# EAGLE design blink1mk3_card (EAGLE 9.0.1)
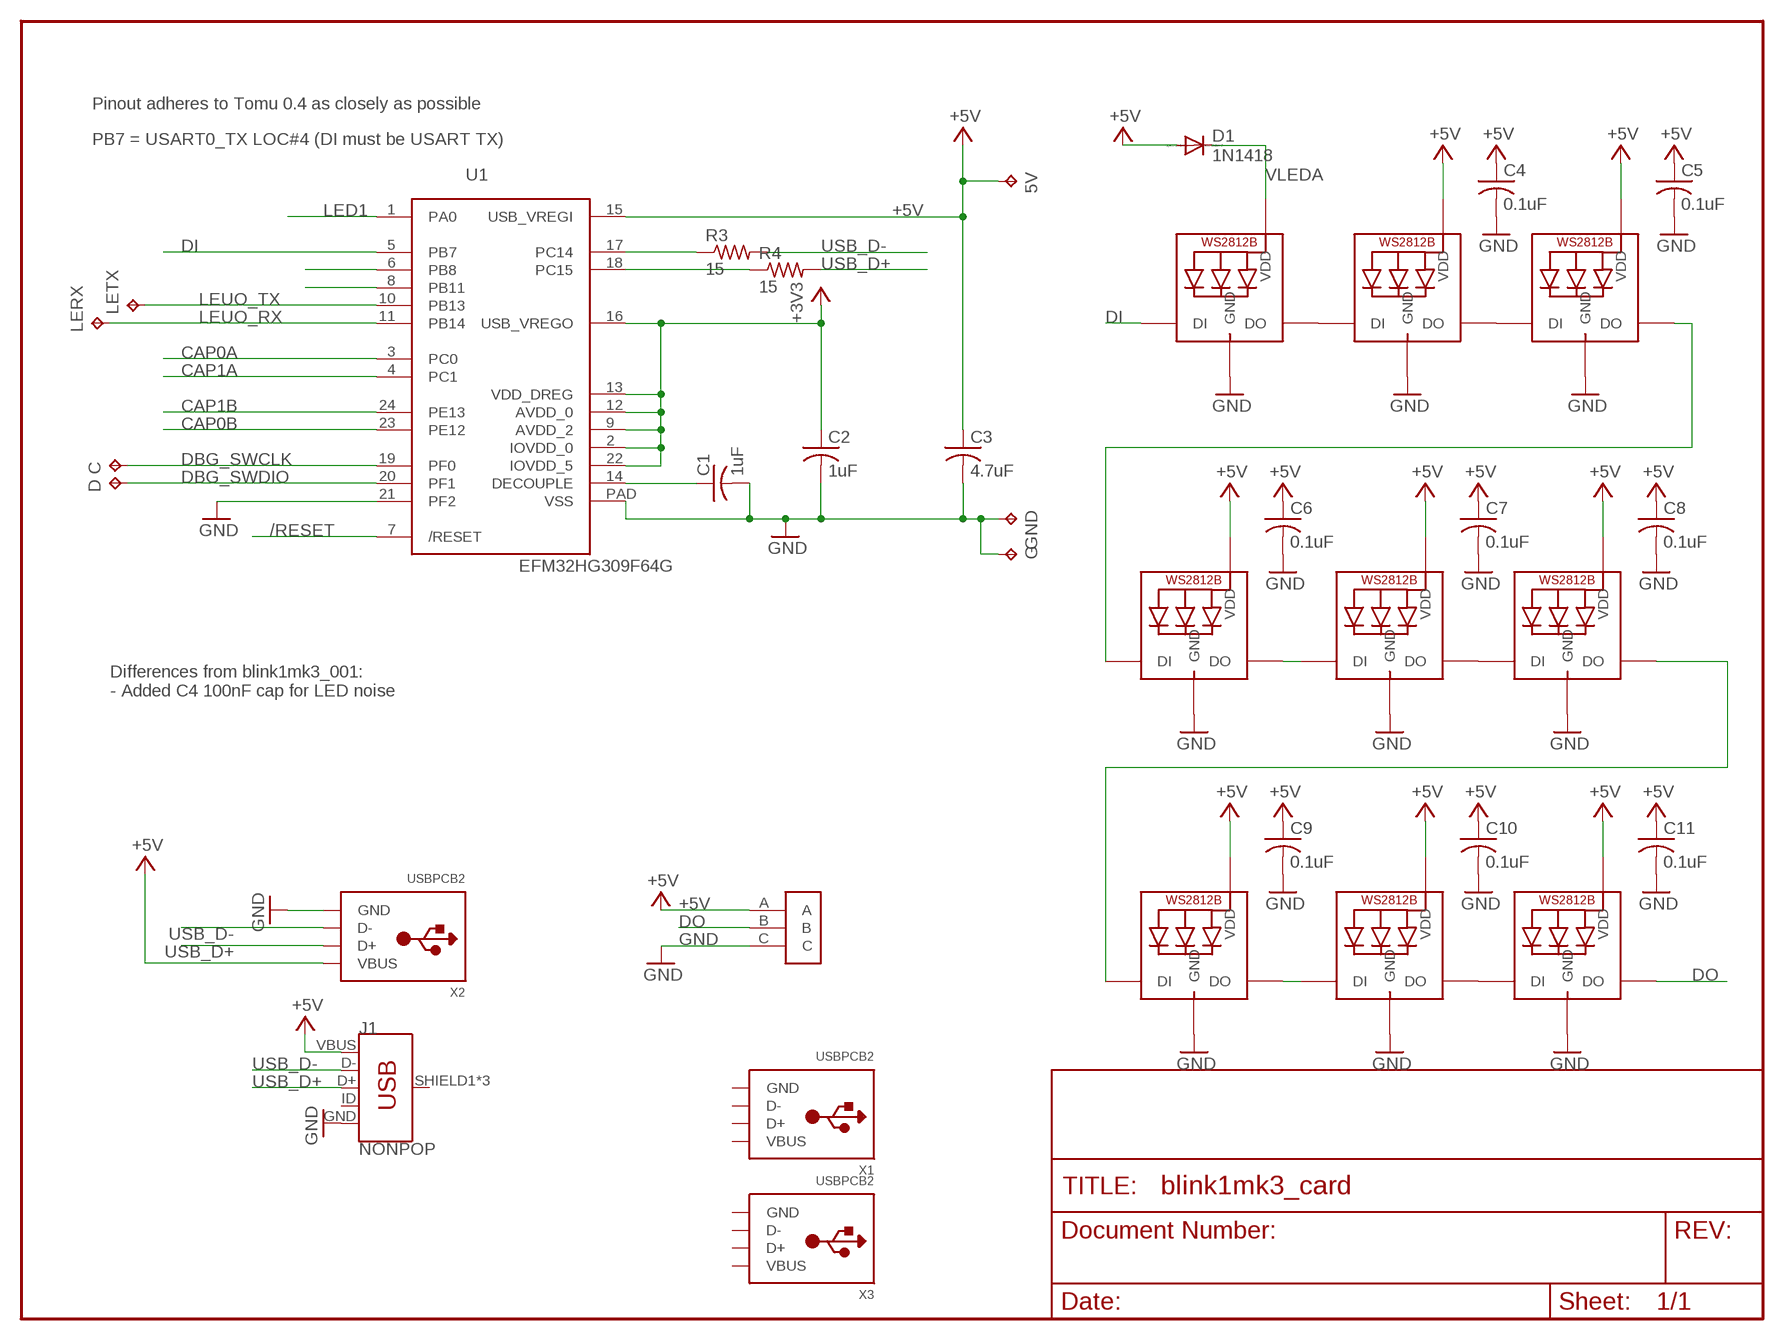
[diagram p0: schematic, sheet 1]

## Parts
5V  TPTP15R  [TP15R]
C  TPTP15R  [TP15R]
C1  1uF  C-USC0603  [C0603]
C2  1uF  C-USC0603  [C0603]
C3  4.7uF  C-USC0603  [C0603]
C4  0.1uF  C-USC0603  [C0603]
C5  0.1uF  C-USC0603  [C0603]
C6  0.1uF  C-USC0603  [C0603]
C7  0.1uF  C-USC0603  [C0603]
C8  0.1uF  C-USC0603  [C0603]
C9  0.1uF  C-USC0603  [C0603]
C10  0.1uF  C-USC0603  [C0603]
C11  0.1uF  C-USC0603  [C0603]
D  TPTP15R  [TP15R]
D1  1N1418  DIODE-SOD523  [SOD523]
G  TPTP14SQ  [TP14SQ]
GND  TPTP14SQ  [TP14SQ]
J1  NONPOP  USB_MICRO-B_FEMALE-SMT  [USB-B-MICRO-SMD]
LED1  SK6812MINI  WS2812B3535  [LED3535]
LED2  SK6812MINI  WS2812B3535  [LED3535]
LED3  SK6812MINI  WS2812B3535  [LED3535]
LED4  SK6812MINI  WS2812B3535  [LED3535]
LED5  SK6812MINI  WS2812B3535  [LED3535]
LED6  SK6812MINI  WS2812B3535  [LED3535]
LED7  SK6812MINI  WS2812B3535  [LED3535]
LED8  SK6812MINI  WS2812B3535  [LED3535]
LED9  SK6812MINI  WS2812B3535  [LED3535]
LERX  TPTP15R  [TP15R]
LETX  TPTP15R  [TP15R]
R3  15  R-US_R0603  [R0603]
R4  15  R-US_R0603  [R0603]
U1  EFM32HG309F64G  [QFN24PAD]
U$1  LED_STRIP_3P  [LEDSTRIP-3P]
X1  USBPCB2  [USB-A-PCB-2]
X2  USBPCB2  [USB-A-PCB-2]
X3  USBPCB2  [USB-A-PCB-2]

## Nets
+3V3: C2.1 U1.2(IOVDD_0) U1.9(AVDD_2) U1.12(AVDD_0) U1.13(VDD_DREG) U1.16(USB_VREGO) U1.22(IOVDD_5)
+5V: 5V.TP C3.1 C4.1 C5.1 C6.1 C7.1 C8.1 C9.1 C10.1 C11.1 D1.A J1.VBUS LED2.2(VDD) LED3.2(VDD) LED4.2(VDD) LED5.2(VDD) LED6.2(VDD) LED7.2(VDD) LED8.2(VDD) LED9.2(VDD) U1.15(USB_VREGI) U$1.A X2.5V(VBUS)
/RESET: U1.7(/RESET)
CAP0A: U1.3(PC0)
CAP0B: U1.23(PE12)
CAP1A: U1.4(PC1)
CAP1B: U1.24(PE13)
DBG_SWCLK: C.TP U1.19(PF0)
DBG_SWDIO: D.TP U1.20(PF1)
DECOUPLE: C1.1 U1.14(DECOUPLE)
DI: LED1.1(DI) U1.5(PB7)
DO: LED9.3(DO) U$1.B
GND: C1.2 C2.2 C3.2 C4.2 C5.2 C6.2 C7.2 C8.2 C9.2 C10.2 C11.2 G.TP GND.TP J1.GND LED1.4(GND) LED2.4(GND) LED3.4(GND) LED4.4(GND) LED5.4(GND) LED6.4(GND) LED7.4(GND) LED8.4(GND) LED9.4(GND) U1.21(PF2) U1.PAD(VSS) U$1.C X2.GND
LED1: U1.1(PA0)
LEUO_RX: LERX.TP U1.11(PB14)
LEUO_TX: LETX.TP U1.10(PB13)
N$1: U1.8(PB11)
N$2: LED1.3(DO) LED2.1(DI)
N$3: U1.6(PB8)
N$4: LED7.3(DO) LED8.1(DI)
N$5: LED4.3(DO) LED5.1(DI)
N$6: LED5.3(DO) LED6.1(DI)
N$7: LED2.3(DO) LED3.1(DI)
N$8: LED3.3(DO) LED4.1(DI)
N$9: LED8.3(DO) LED9.1(DI)
N$10: LED6.3(DO) LED7.1(DI)
RUSB_D+: R4.1 U1.18(PC15)
RUSB_D-: R3.1 U1.17(PC14)
USB_D+: J1.D+ R4.2 X2.USB_P(D+)
USB_D-: J1.D- R3.2 X2.USB_M(D-)
VLEDA: D1.C LED1.2(VDD)
Unconnected: J1.ID J1.SHIELD1(SHIELD) J1.SHIELD2(SHIELD) J1.SHIELD3(SHIELD) X1.USB_M(D-) X1.USB_P(D+) X3.USB_M(D-) X3.USB_P(D+)

## Notes on the sheet
- Pinout adheres to Tomu 0.4 as closely as possible
- PB7 = USART0_TX LOC#4 (DI must be USART TX)
- Differences from blink1mk3_001:
  - Added C4 100nF cap for LED noise

## Power pins joined to a net without a drawn wire
GND: X1.GND X3.GND
VBUS: X1.5V(VBUS) X3.5V(VBUS)

## Library data of the parts
5V C D G GND LERX LETX = testpad:TP: Test pad
C1-C11 = adafruit:C-US: CAPACITOR, American symbol
D1 = diode:DIODE-: DIODE
J1 = SparkFun-Connectors:USB_MICRO-B: USB Type Micro-B Connector Male/female and PTH/SMT variants SparkFun Products: SparkFun microB USB Breakout <https://www.sparkfun.com/products/12035> SparkFun USB microB Plug Breakout <https://www.sparkfun.com/products/10031> SparkFun ESP8266 Thing <https://www.sparkfun.com/products/13231>; PROD_ID: CONN-11752
LED1-LED9 = adafruit:WS2812B
R3 R4 = adafruit:R-US_: RESISTOR, American symbol
U1 = todstuff:EFM32HG309F64G
U$1 = NeoJoints:LED_STRIP_3P: NeoJoint pads for WS2812 / NeoPixel LED strips
X1-X3 = todstuff:USB

## Board
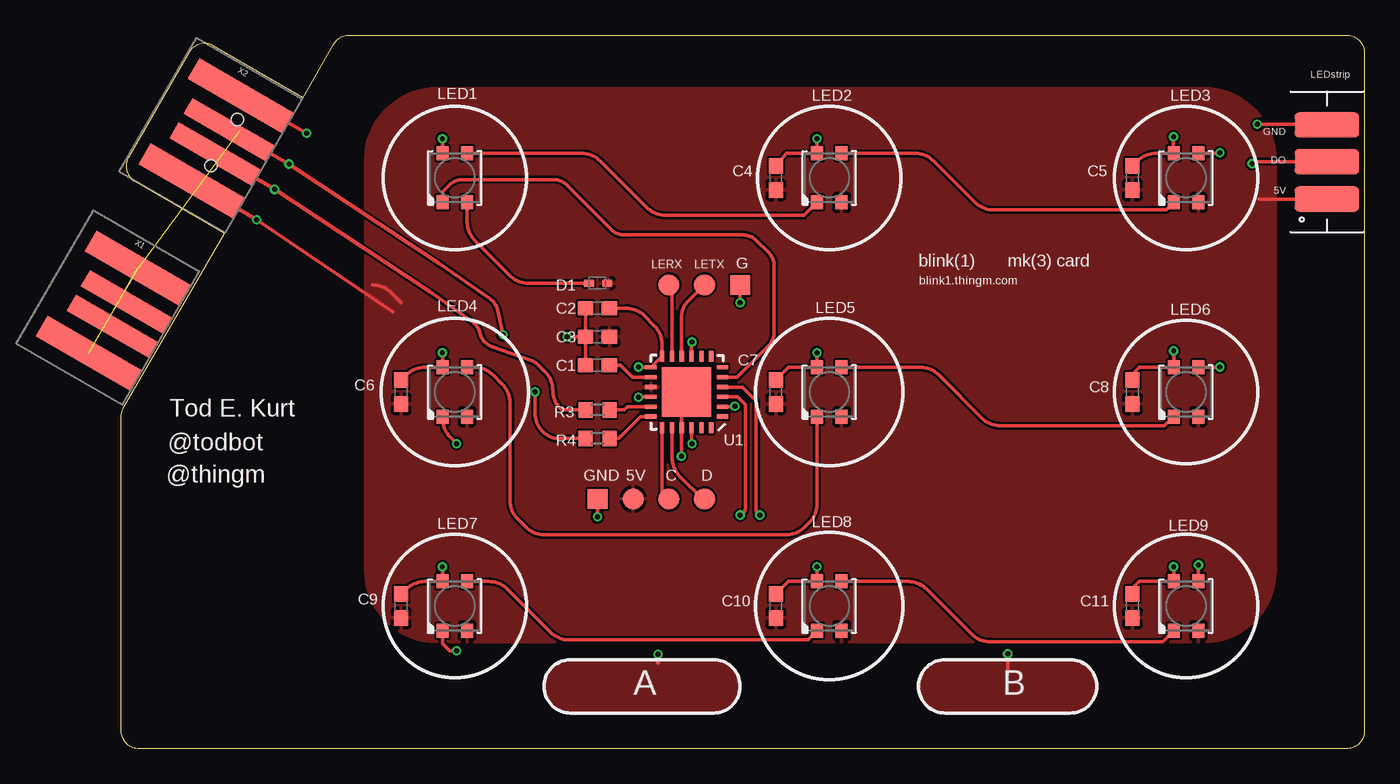
[diagram p1: board, top side]
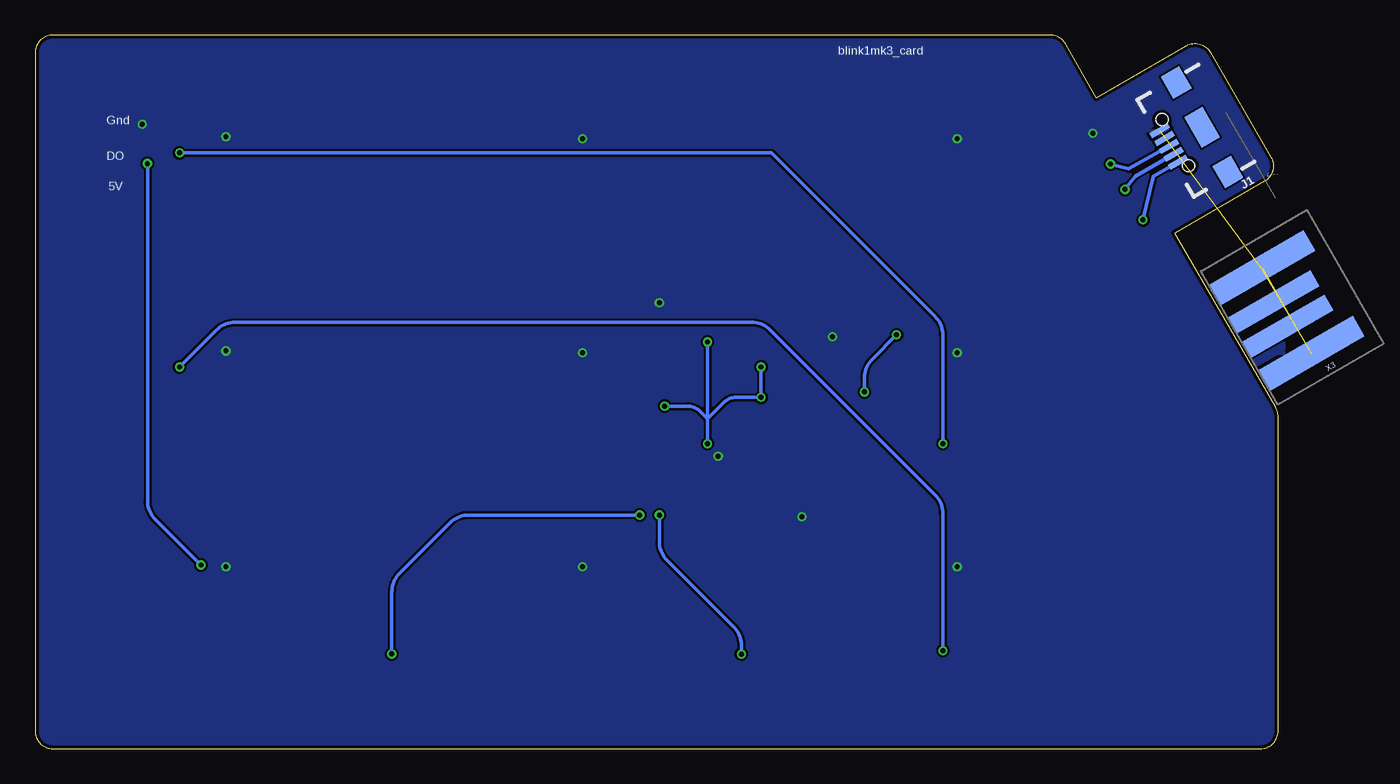
[diagram p2: board, bottom side, seen from below]

Size 88.52 x 50.8 mm. Coordinates in mm from the lower left corner, seen from the top.
Outline: 12.95,46.35 15.13,50.16 arc-60 16.23,50.8 87.25,50.8 arc-90 88.52,49.53 88.52,1.27 arc-90 87.25,0 1.27,0 arc-90 0,1.27 0,23.66 arc-30 0.17,24.3 7.37,36.7 0.98,40.39 arc-90 0.51,42.12 4.83,49.58 arc-90 6.56,50.04 12.95,46.35
Copper layers (1*16): Top 0.035mm / dielectric 1.5mm / Bottom 0.035mm
Design rules "SeeedStudio_2layer_DRU_no_angle_20140221": minimum track width 6mil, minimum drill 12mil, track to track 6mil, track to pad 6mil, pad to pad 6mil, via to via 6mil, smd to smd 0mil, copper to edge 10mil, drill to drill 10mil, minimum pad ring 10mil, minimum via ring 6mil, stop-mask expansion 2mil, vias tented up to drill 100mil, thermal gap 10mil

### Footprints (pad centres in the part's own frame; a part is rotated, then mirrored left to right if it is on the bottom)
TP15R = smd 1.5 x 1.5: TP 0,0
C0603 = smd 1.1 x 1: 1 -0.85,0; 2 0.85,0
SOD523 = smd 0.7 x 0.5: A 0.7,0; C -0.6,0
TP14SQ = smd 1.4 x 1.4: TP 0,0
USB-B-MICRO-SMD = smd 1.45 x 0.4: D+ 2.725,0; D- 2.725,0.65; GND 2.725,-1.3; ID 2.725,-0.65; VBUS 2.725,1.3 | smd 1.5 x 1.8: SHIELD1 0,3.685; SHIELD2 0,-3.685 | smd 1.5 x 2.5: SHIELD3 0,0 | hole 0.85: 2.2,1.9; 2.2,-1.9
LED3535 = smd 1 x 0.85: 1 -1.75,0.875; 2 -1.75,-0.875; 3 1.75,-0.875; 4 1.75,0.875
R0603 = smd 1 x 1.1: 1 -0.85,0; 2 0.85,0
QFN24PAD = smd 0.8 x 0.3: 1 -2.55,1.75; 2 -2.55,1.05; 3 -2.55,0.35; 4 -2.55,-0.35; 5 -2.55,-1.05; 6 -2.55,-1.75; 13 2.55,-1.75; 14 2.55,-1.05; 15 2.55,-0.35; 16 2.55,0.35; 17 2.55,1.05; 18 2.55,1.75 | smd 0.3 x 0.8: 7 -1.75,-2.55; 8 -1.05,-2.55; 9 -0.35,-2.55; 10 0.35,-2.55; 11 1.05,-2.55; 12 1.75,-2.55; 19 1.75,2.55; 20 1.05,2.55; 21 0.35,2.55; 22 -0.35,2.55; 23 -1.05,2.55; 24 -1.75,2.55 | smd 3.5 x 3.5: PAD 0,0
LEDSTRIP-3P = smd 4.6 x 1.8: A 0,-2.65; B 0,0; C 0,2.63
USB-A-PCB-2 = smd 7.75 x 1.69: 5V -1.47,-3.5; GND -1.47,3.5 | smd 6.75 x 1.3: USB_M -0.97,-1; USB_P -0.97,1

### Placement (x,y rotation side)
5V  36.45,17.78 0 top
C  38.99,17.78 0 top
C1  33.91,27.3 180 top
C2  33.91,31.37 180 top
C3  33.91,29.34 180 top
C4  46.61,40.64 90 top
C5  72.01,40.64 90 top
C6  19.94,25.4 90 top
C7  46.61,25.4 90 top
C8  72.01,25.4 90 top
C9  19.94,10.16 90 top
C10  46.61,10.16 90 top
C11  72.01,10.16 90 top
D  41.53,17.78 0 top
D1  33.91,33.15 0 top
G  44.07,33.02 0 top
GND  33.91,17.78 0 top
J1  5.42,44.24 210 bottom
LED1  23.75,40.64 90 top
LED2  50.42,40.64 90 top
LED3  75.82,40.64 90 top
LED4  23.75,25.4 90 top
LED5  50.42,25.4 90 top
LED6  75.82,25.4 90 top
LED7  23.75,10.16 90 top
LED8  50.42,10.16 90 top
LED9  75.82,10.16 90 top
LERX  38.99,33.02 0 top
LETX  41.53,33.02 180 top
R3  33.91,24.13 180 top
R4  33.91,22.1 180 top
U1  40.26,25.4 180 top
U$1  85.85,41.78 0 top
X1  0.71,30.45 330 top
X2  8.04,42.71 330 top
X3  0.66,30.46 210 bottom

### Tracks (layer width: path | path; a pad name or v marks a point on that pad's centre or on a via)
+3V3  (via drill 0.35)
  Top 0.254: C2.1 35.91,31.37 arc-45 37.26,30.81 37.95,30.12 arc-45 38.51,28.77 U1.12 U1.13 36.86,27.15 v36.83,27.18 | U1.16 36.86,25.05 v36.83,25.02 | U1.22 40.61,21.75 v40.64,21.72 | U1.9 40.61,28.92 v40.64,28.96 | U1.2 43.65,24.35 v43.69,24.38
  Bottom 0.254: 40.64,23.49 39.49,24.65 arc45 38.59,25.02 v36.83,25.02 v36.83,27.18 | 40.64,23.49 v40.64,21.72 | v40.64,28.96 40.64,23.49 | v43.69,24.38 42.05,24.38 arc45 41.16,24.01 40.64,23.49
+5V  (via drill 0.35)
  Top 0.254: U$1.A 81.04,39.13 81.03,39.12 | 17.88,33.02 arc-45 19.23,32.46 19.94,31.75 | X2.5V v9.64,37.65 19.3,31.11
  Bottom 0.254: J1.VBUS 8.89,40.77 v9.64,37.65
  pour Top: 17.4,41.91 17.4,12.7 arc90 22.48,7.62 77.09,7.62 arc90 82.17,12.7 82.17,41.91 arc90 77.09,46.99 22.48,46.99 arc90
CAP0A  (via drill 0.35)
  Top 0.254: v44.07,16.64 44.2,16.64 arc45 44.45,17.25 44.45,24.48 43.88,25.05 U1.3 | v38.23,6.73 38.23,6.1
  Bottom 0.254: v44.07,16.64 44.07,14.76 arc-45 43.51,13.41 38.79,8.69 arc45 38.23,7.34 v38.23,6.73
  pour Top: 32,6.35 42.16,6.35 arc-90 44.07,4.45 arc-90 42.16,2.54 32,2.54 arc-90 30.1,4.45 arc-90
CAP1A  (via drill 0.35)
  Top 0.254: U1.4 44.23,25.75 45.21,24.76 45.21,16.89 v45.47,16.64 | v63.12,6.75 63.12,5.33
  Bottom 0.254: v45.47,16.64 57.63,16.64 arc-45 58.98,16.08 62.56,12.5 arc-45 63.12,11.15 v63.12,6.75
  pour Top: 58.67,6.35 67.56,6.35 arc-90 69.47,4.45 arc-90 67.56,2.54 58.67,2.54 arc-90 56.77,4.45 arc-90
DBG_SWCLK
  Top 0.254: C.TP 38.51,18.26 U1.19
DBG_SWDIO
  Top 0.254: U1.20 39.21,20.76 arc45 39.77,19.41 41.4,17.78 D.TP
DECOUPLE
  Top 0.254: C1.1 35.56,27.3 36.42,26.45 U1.14
DI
  Top 0.254: LED1.1 22.87,39.61 22.86,39.62 23.38,40.14 arc-45 24.28,40.51 30.82,40.51 arc-45 31.71,40.14 34.91,36.95 arc45 35.81,36.58 44.3,36.58 arc-45 45.2,36.2 46.11,35.3 arc-45 46.48,34.4 46.48,29.61 arc-45 46.11,28.71 43.85,26.45 U1.5
DO  (via drill 0.35)
  Top 0.254: v76.71,13.08 76.69,13.07 LED9.3 | U$1.B 80.65,41.78 arc90 v80.52,41.66
  Bottom 0.254: v80.52,41.66 80.52,17.68 arc-45 79.96,16.33 v76.71,13.08
GND  (via drill 0.35)  (2 unrouted)
  Top 0.254: LED1.4 22.87,43.42 v22.86,43.43 | C6.2 20.28,26.59 arc-45 21.63,27.15 LED4.4 22.87,28.18 v22.86,28.19 | C4.2 47.38,42.39 LED2.4 49.54,43.42 v49.53,43.43 | C5.2 72.35,41.83 arc-45 73.7,42.39 LED3.4 74.93,42.4 v74.93,43.56 | v74.93,28.32 74.94,28.31 LED6.4 72.49,27.15 72.01,26.67 C8.2 | C7.2 47.51,27.15 LED5.4 49.54,28.18 v49.53,28.19 | C10.2 47.51,11.91 LED8.4 49.54,12.94 v49.53,12.95 | v74.93,12.95 74.94,12.94 LED9.4 72.49,11.91 72.01,11.43 C11.2 | v22.86,12.95 22.87,12.94 LED7.4 21.63,11.91 arc45 20.28,11.35 C9.2 | C1.2 C3.2 | C3.2 C2.2 | C3.2 v31.75,29.34 | U1.PAD 40.26,24.64 39.91,24.29 U1.21 39.91,22.26 39.88,21.59 v39.88,20.83 | GND.TP v33.91,16.51 | U$1.C arc90 85.81,44.45 v80.9,44.45 | G.TP v44.07,31.75 | X2.GND v13.21,43.81
  pour Bottom: 88.52,50.8 -0.38,50.8 -0.38,0 88.52,0
LEUO_RX
  Top 0.254: U1.11 39.21,32.8 LERX.TP
LEUO_TX
  Top 0.254: U1.10 39.91,30.87 arc-45 40.28,31.77 LETX.TP
N$2
  Top 0.254: LED1.3 32.77,42.39 arc-45 34.11,41.83 37.42,38.53 arc45 38.76,37.97 48.63,37.97 LED2.1
N$4
  Top 0.254: LED7.3 26.16,11.91 arc-45 27.51,11.35 30.56,8.3 arc45 31.9,7.75 48.88,7.75 LED8.1
N$5
  Top 0.254: LED4.3 25.15,27.15 arc-45 26.49,26.59 27.13,25.96 arc-45 27.69,24.61 27.69,17.68 arc45 28.24,16.33 28.78,15.8 arc45 30.13,15.24 47.34,15.24 arc45 48.69,15.8 48.97,16.08 arc45 49.53,17.43 49.53,23.64 LED5.1
N$6
  Top 0.254: LED5.3 56.9,27.15 arc-45 58.24,26.59 61.29,23.54 arc45 62.64,22.99 74.28,22.99 LED6.1
N$7
  Top 0.254: LED2.3 56.52,42.39 arc-45 57.86,41.83 60.78,38.91 arc45 62.13,38.35 74.41,38.35 LED3.1
N$8  (via drill 0.35)
  Top 0.254: 76.79,42.29 LED3.3 78.23,42.39 v78.23,42.42 | v23.88,21.72 23.43,22.16 arc-45 22.87,23.51 LED4.1
  Bottom 0.254: v78.23,42.42 36.07,42.42 24.43,30.78 arc45 23.88,29.44 v23.88,21.72
N$9
  Top 0.254: LED8.3 56.01,11.91 arc-45 57.36,11.35 60.53,8.18 arc45 61.88,7.62 74.15,7.62 LED9.1
N$10  (via drill 0.35)
  Top 0.254: LED6.3 78.2,27.15 v78.23,27.18 | v23.88,6.98 23.37,6.98 22.87,7.48 LED7.1
  Bottom 0.254: v23.88,6.98 23.88,16.74 arc-45 24.43,18.08 36.15,29.79 arc-45 37.49,30.35 74.27,30.35 arc-45 75.62,29.79 v78.23,27.18
RUSB_D+
  Top 0.254: U1.18 36.98,23.65 35.43,22.1 R4.1
RUSB_D-
  Top 0.254: U1.17 36.03,24.35 35.81,24.13 R3.1
USB_D+  (via drill 0.35)
  Top 0.254: v29.46,25.4 29.46,23.9 arc45 30.02,22.56 arc45 31.13,22.1 R4.2 | X2.USB_P v11.94,41.62 22.65,34.54 26.26,32.03 arc-43 26.78,31.27 v27.18,29.46
  Bottom 0.254: v27.18,29.46 28.91,27.74 arc-45 29.46,26.39 v29.46,25.4 | J1.D+ 10.67,41.27 v11.94,41.62
USB_D-  (via drill 0.35)
  Top 0.254: R3.2 31.53,24.13 arc-45 31.25,24.24 arc-45 30.73,25.5 arc45 30.18,26.85 29.72,27.31 arc26 29.24,27.6 26.39,28.61 arc-54 25.6,29.45 25.53,29.68 arc38 25.05,30.35 22,32.52 v10.91,39.81 X2.USB_M
  Bottom 0.254: J1.D- 10.16,40.77 v10.91,39.81
VBUS  (1 unrouted)
VLEDA
  Top 0.254: D1.C 28.98,33.15 arc-45 27.64,33.7 25.2,36.14 arc-45 24.64,37.49 24.64,38.88 LED1.2

### Text on the board
tPlace: LEDstrip | GND | DO | 5V | blink(1) | mk(3) card | blink1.thingm.com | Tod E. Kurt | @todbot | @thingm | A | B
bPlace: blink1mk3_card | Gnd | DO | 5V